# EasyEDA schematic LineSensor.json
TITLE: Sheet_1; REV: 1.0; Date: 2025-01-12; Sheet: 1/1; Company: Your Company
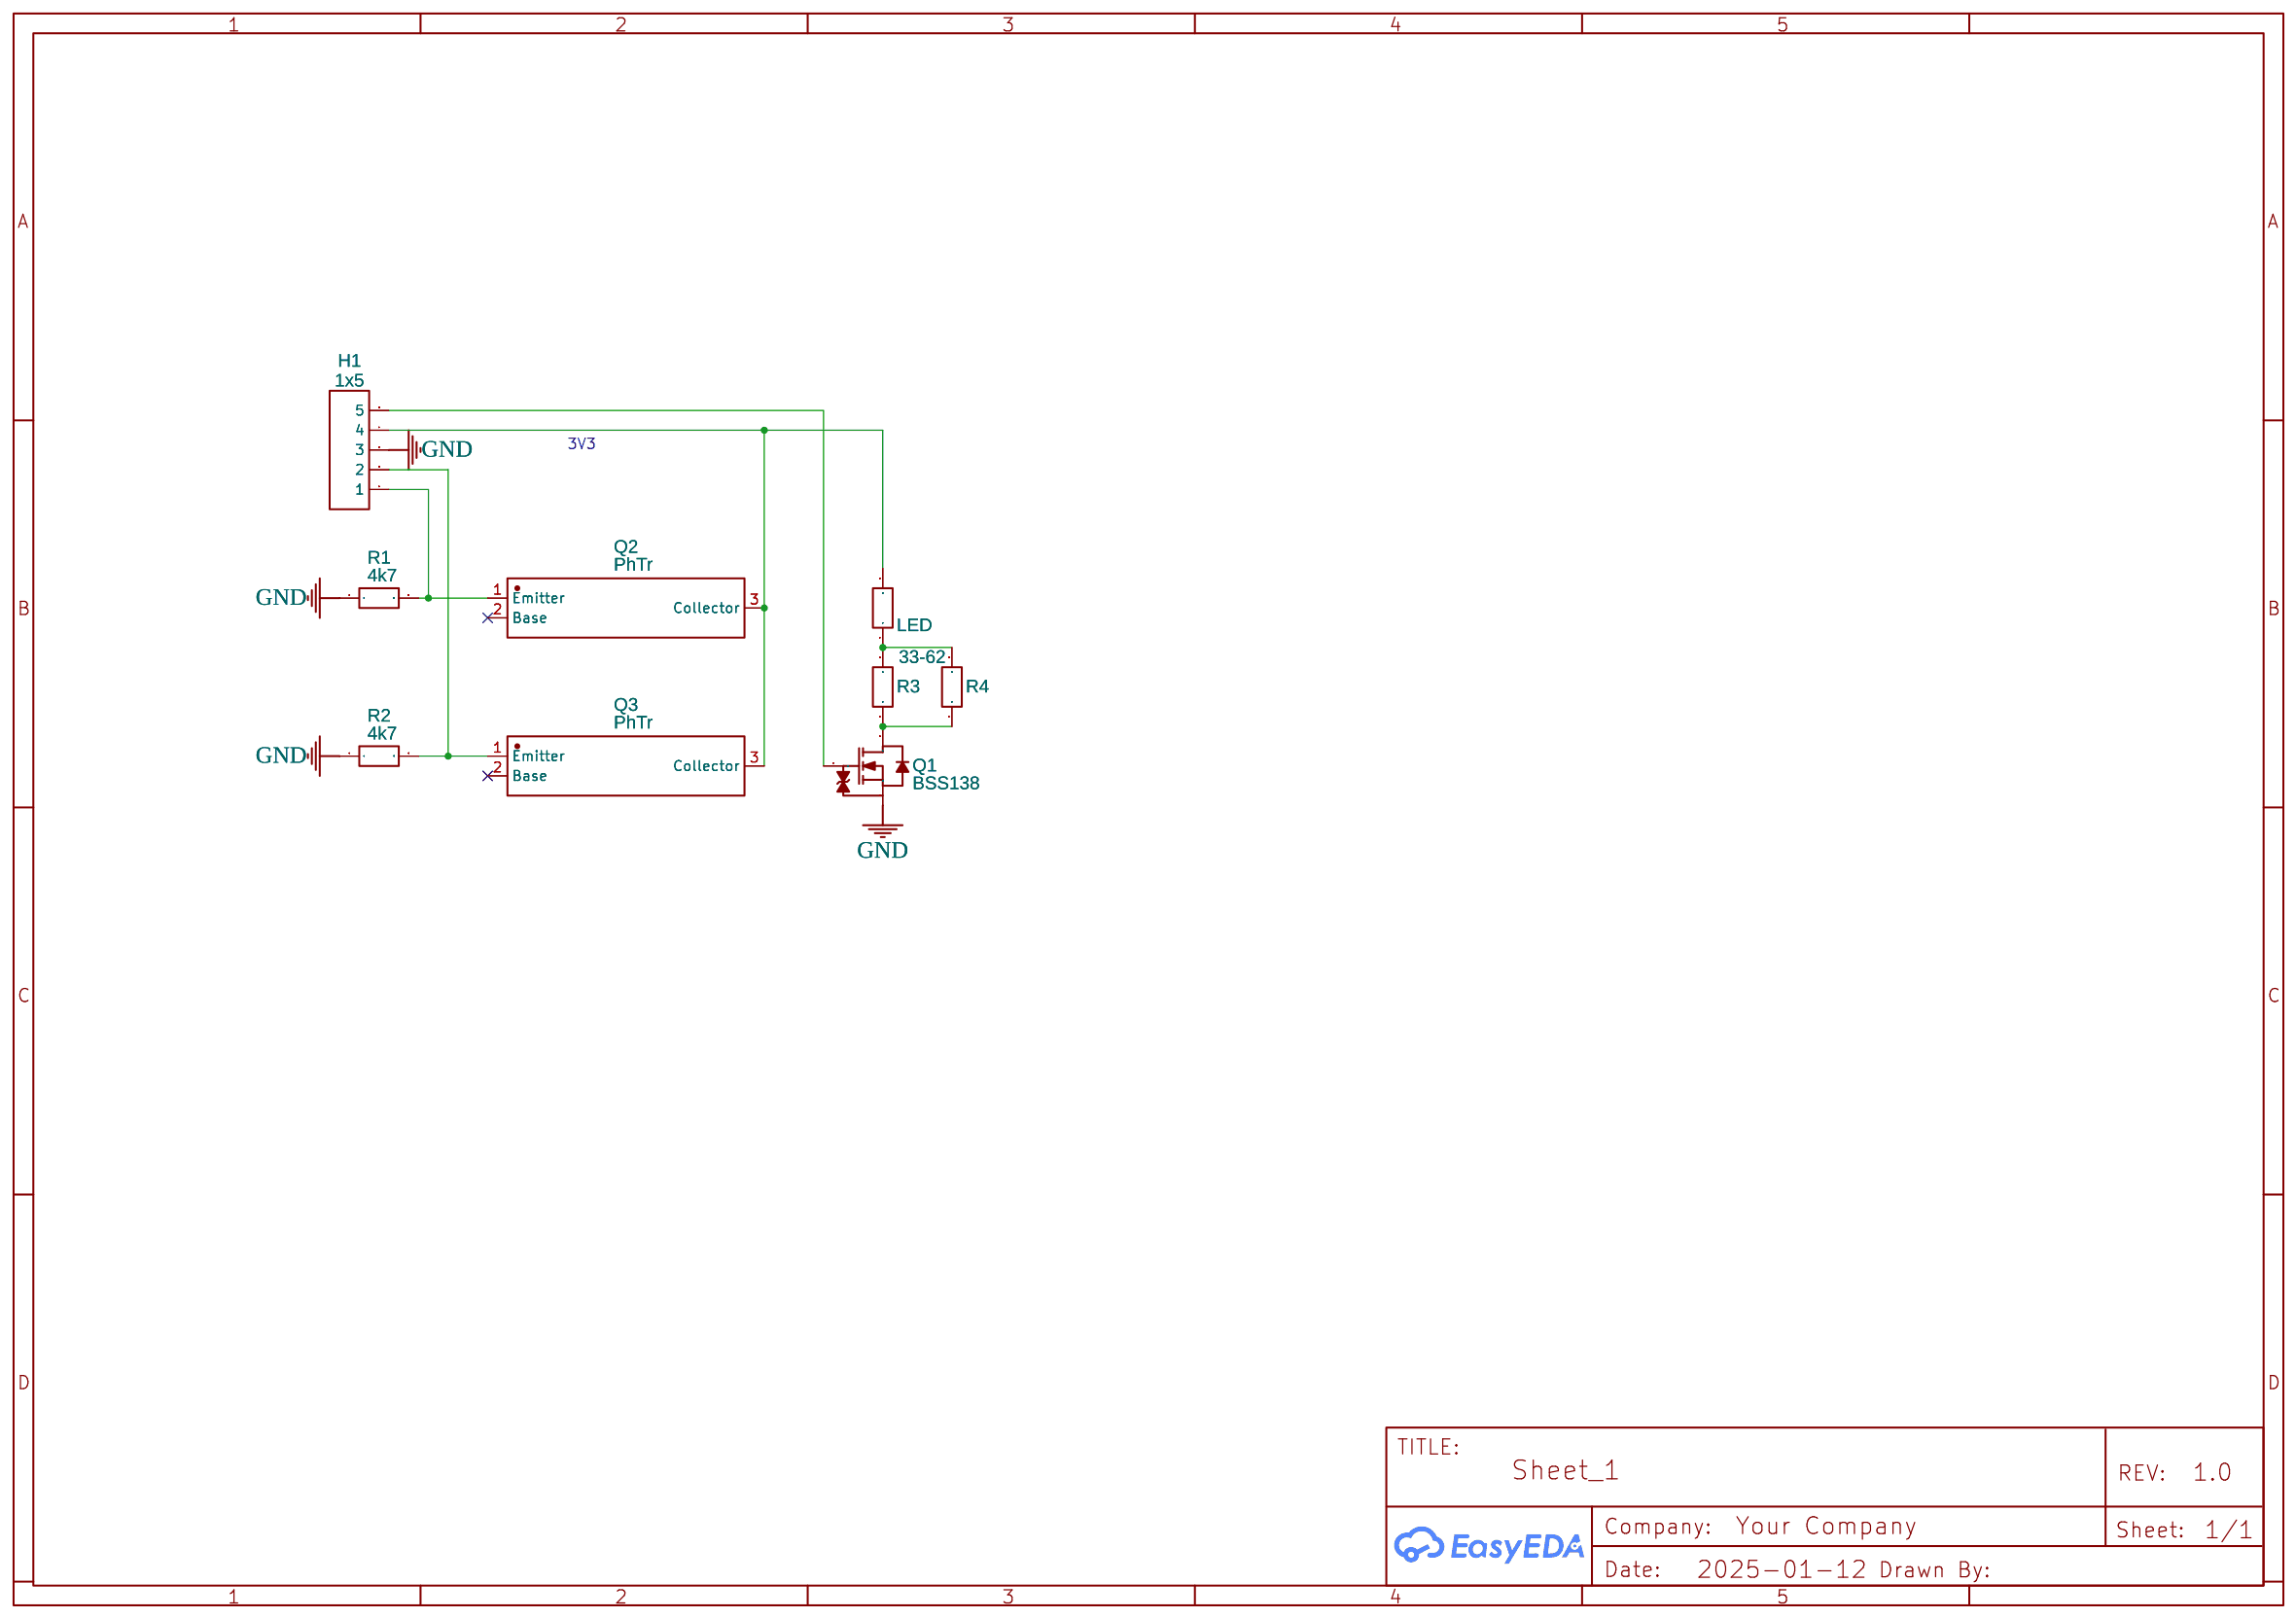
[diagram p0: schematic sheet]

## Parts
H1  1x5  [HDR-F-2.54_1X5]
Q1  BSS138  [SOT-23-3_L2.9-W1.3-P1.90-LS2.4-BR]
Q2  PhTr  [TO-18-3_BD5.4-P2.54]
Q3  PhTr  [TO-18-3_BD5.4-P2.54]
R1  4k7  [R1206]
R2  4k7  [R1206]
R3  33  [R1206]
R4  33-62  [R_AXIAL-0.3]
R5  LED  [R_AXIAL-0.6]

## Library data of the parts
H1 = HDR-F-2.54_1x5: Supplier Part: C50950; Supplier: LCSC; Contributor: LCEDA_Lib
Q1 = BSS138BK: Contributor: lcsc; Supplier: LCSC; Supplier Part: C5224267; Manufacturer: ElecSuper(静芯微); JLCPCB Part Class: Extended Part
Q2 Q3 = BC107 PBFREE: Supplier: LCSC; Supplier Part: C5952780; Manufacturer: Central(中环); Contributor: lcsc
R1-R3 = R_1206_EU: Contributor: LCEDA_Lib
R4 = R_AXIAL-0.3_EU: Contributor: LCEDA_Lib
R5 = R_AXIAL-0.6_EU: Contributor: LCEDA_Lib

## Nets
GND: H1.3 Q1.2(S) R1.1 R2.1
Net-(H1-1): H1.1 Q2.1(Emitter) R1.2
Net-(H1-2): H1.2 Q3.1(Emitter) R2.2
Net-(H1-4): H1.4 Q2.3(Collector) Q3.3(Collector) R5.2
Net-(H1-5): H1.5 Q1.1(G)
Net-(Q1-3): Q1.3(D) R3.1 R4.1
Net-(R3-2): R3.2 R4.2 R5.1

Not connected (* = marked no-connect by the designer): Q2 2(Base)*; Q3 2(Base)*

## Notes on the sheet
- 3V3
